# Altium project 自控mosV1.0.PrjPCB
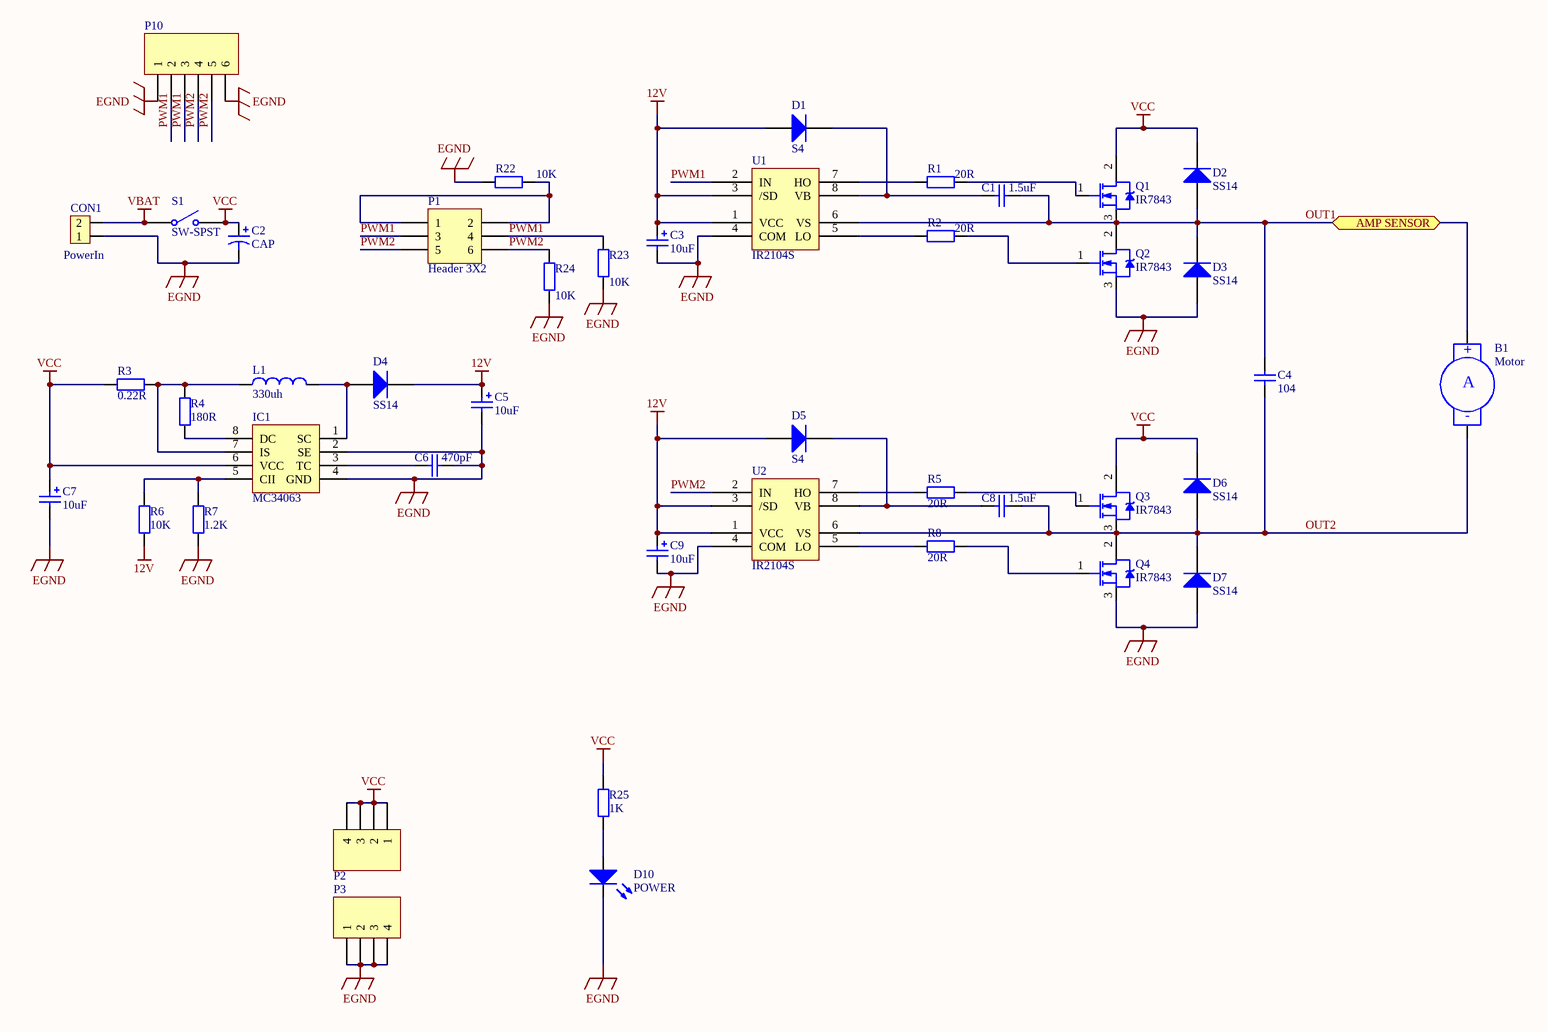
[diagram p0: 自控mosV1.0.SchDoc]
2 sheets, 103 parts. Net scope: flat (ports and power ports of the same name join across sheets).
Board files: 自控mos驱动.PcbDoc, 自控开板V1.PcbDoc
Sheets:
  自控mosV1.0.SchDoc
  主控板加电流检测v1.SchDoc

## Sheet 自控mosV1.0.SchDoc
size A3

### Parts
B1  Motor  [KF301-2P]
C1  value 1.5uF  [C2012]  (hidden comment: Cap)
C2  CAP  [SMD-EC-F5]
C3  value 10uF  [C2012]  (hidden comment: Cap Pol1)
C4  value 104  [C2012]  (hidden comment: Cap)
C5  value 10uF  [1206C]  (hidden comment: Cap Pol1)
C6  value 470pF  [C2012]  (hidden comment: Cap)
C7  value 10uF  [1206C]  (hidden comment: Cap Pol1)
C8  value 1.5uF  [C2012]  (hidden comment: Cap)
C9  value 10uF  [C2012]  (hidden comment: Cap Pol1)
CON1  PowerIn  [KF301-2P]
D1  S4  [R2012]
D2  SS14  [hole-chip diode]
D3  SS14  [hole-chip diode]
D4  SS14  [hole-chip diode]
D5  S4  [R2012]
D6  SS14  [hole-chip diode]
D7  SS14  [hole-chip diode]
D10  POWER  [C2012]
IC1  MC34063  [MC34063]
L1  value 330uh  [SMD-EC-F12.5]  (hidden comment: Inductor)
P1  Header 3X2  [HDR2X3]
P2  Header 4  [HDR1X4]  (value not drawn)
P3  Header 4  [HDR1X4]  (value not drawn)
P10  Header 6  [FFC/SM1.0-2H6]  (value not drawn)
Q1  IR7843  [LR7843]
Q2  IR7843  [LR7843]
Q3  IR7843  [LR7843]
Q4  IR7843  [LR7843]
R1  value 20R  [R2012]  (hidden comment: Res2)
R2  value 20R  [R2012]  (hidden comment: Res2)
R3  value 0.22R  [SK54]  (hidden comment: Res2)
R4  value 180R  [R2012]  (hidden comment: Res2)
R5  value 20R  [R2012]  (hidden comment: Res2)
R6  value 10K  [R2012]  (hidden comment: Res2)
R7  value 1.2K  [R2012]  (hidden comment: Res2)
R8  value 20R  [R2012]  (hidden comment: Res2)
R22  value 10K  [1206(2)]  (hidden comment: Res2)
R23  value 10K  [R2012]  (hidden comment: Res2)
R24  value 10K  [R2012]  (hidden comment: Res2)
R25  1K  [R2012]
S1  SW-SPST  [SW-125V6A(-)]
U1  IR2104S  [IR2104]
U2  IR2104S  [IR2104]

### Ports
AMP SENSOR

### Nets
12V: C3.1 C5.1 C9.1 D1.1(A) D4.2(K) D5.1(A) R6.1 U1.1(VCC) U1.3(/SD) U2.1(VCC) U2.3(/SD)
EGND: C2.2 C3.2 C5.2 C6.1 C7.2 C9.2 CON1.1 D3.1(A) D7.1(A) D10.2 IC1.2(SE) IC1.4(GND) P3.1 P3.2 P3.3 P3.4 P10.1 P10.6 Q2.3(S) Q4.3(S) R7.1 R22.1 R23.1 R24.1 U1.4(COM) U2.4(COM)
VBAT: CON1.2 S1.1(COMMON)
VCC: C2.1 C7.1 D2.2(K) D6.2(K) IC1.6(VCC) P2.1 P2.2 P2.3 P2.4 Q1.2(D) Q3.2(D) R3.1 R25.2 S1.2(NO)
OUT1: B1.1(+) C1.1 C4.1 D2.1(A) D3.2(K) Q1.3(S) Q2.2(D) U1.6(VS) ; port AMP SENSOR
OUT2: B1.2(-) C4.2 C8.1 D6.1(A) D7.2(K) Q3.3(S) Q4.2(D) U2.6(VS)
PWM1: P1.3 P1.4 P10.2 P10.3 R23.2 U1.2(IN)
PWM2: P1.5 P1.6 P10.4 P10.5 R24.2 U2.2(IN)
NetC1_2: C1.2 D1.2(K) U1.8(VB)
NetC6_2: C6.2 IC1.3(TC)
NetC8_2: C8.2 D5.2(K) U2.8(VB)
NetD4_1: D4.1(A) IC1.1(SC) L1.2
NetD10_1: D10.1 R25.1
NetIC1_5: IC1.5(CII) R6.2 R7.2
NetIC1_7: IC1.7(IS) L1.1 R3.2 R4.2
NetIC1_8: IC1.8(DC) R4.1
NetP1_1: P1.1 P1.2 R22.2
NetQ1_1: Q1.1(G) R1.2
NetQ2_1: Q2.1(G) R2.2
NetQ3_1: Q3.1(G) R5.2
NetQ4_1: Q4.1(G) R8.2
NetR1_1: R1.1 U1.7(HO)
NetR2_1: R2.1 U1.5(LO)
NetR5_1: R5.1 U2.7(HO)
NetR8_1: R8.1 U2.5(LO)

### Notes on the sheet
- (in symbol Motor Servo) A

### Library data of the parts
B1 = Motor Servo: Servo Motor
C1 C4 C6 C8 = Cap: Capacitor; Published: 8-Jun-2000; LatestRevisionDate: 17-Jul-2002; LatestRevisionNote: Re-released for DXP Platform.; PackageReference: RAD-0.3; Publisher: Altium Limited; PackageDescription: Radial Cap, Thru-Hole; 2 Leads; 0.3 in Pin Spacing
C2 = CAP+
C3 C5 C7 C9 = Cap Pol1: Polarized Capacitor (Radial); Published: 8-Jun-2000; LatestRevisionDate: 17-Jul-2002; LatestRevisionNote: Re-released for DXP Platform.; PackageReference: RB7.6-15; Publisher: Altium Limited; PackageDescription: Polarized Capacitor (Radial); 2 Leads
CON1 = Header 2: Header, 2-Pin
D1-D7 = Diode 1N4007: 1 Amp General Purpose Rectifier; Published: 8-Jun-2000; LatestRevisionDate: 17-Jul-2002; LatestRevisionNote: Re-released for DXP Platform.; DatasheetVersion: 1998; PackageVersion: Aug-1999; PackageReference: DO-41; Publisher: Altium Limited; Code_JEDEC: DO-204-AL; ComponentLink1Description: Manufacturer Link; ComponentLink1URL: http://www.fairchildsemi.com/; ComponentLink2Description: Datasheet; ComponentLink2URL: http://www.fairchildsemi.com/ds/1N%2F1N4001.pdf
D10 = LED: Typical INFRARED GaAs LED
L1 = Inductor: Code_IEC: 1005; Published: 8-Jun-2000; LatestRevisionDate: 29-May-2009; LatestRevisionNote: IPC-7351 Footprint Added.; PackageReference: 0402-A; Publisher: Altium Limited; PackageDescription: Chip Inductor; Code_JEITA: 0402
P1 = Header 3X2: Header, 3-Pin, Dual row; LatestRevisionDate: 17-Jul-2002; LatestRevisionNote: Re-released for DXP Platform.; Publisher: Altium Limited
P2 P3 = Header 4: Header, 4-Pin; LatestRevisionDate: 17-Jul-2002; LatestRevisionNote: Re-released for DXP Platform.; Publisher: Altium Limited
P10 = Header 6: Header, 6-Pin; LatestRevisionDate: 17-Jul-2002; LatestRevisionNote: Re-released for DXP Platform.; Publisher: Altium Limited
Q1-Q4 = NMOS-2: N-Channel Power MOSFET; Note: Pin 2 is electrically connected to pin 4.; Published: 8-Jun-2000; LatestRevisionDate: 17-Jul-2002; LatestRevisionNote: Re-released for DXP Platform.; DatasheetVersion: PD-9.814; PackageVersion: Feb-1997; PackageReference: TO-220AB; Publisher: Altium Limited; PackageDescription: TO, Thru-Hole, Vertical, Heatsink Mounted; 3 In-Line Leads; Pitch 2.54 mm; ComponentLink1Description: Manufacturer Link; ComponentLink1URL: http://www.irf.com/
R1 R2 R4-R8 R22-R24 = Res2: Resistor; Published: 8-Jun-2000; LatestRevisionDate: 17-Jul-2002; LatestRevisionNote: Re-released for DXP Platform.; PackageReference: AXIAL-0.4; Publisher: Altium Limited; PackageDescription: Axial Device, Thru-Hole; 2 Leads; 0.4 in Pin Spacing
R3 = Res2: Resistor; pin to pad: 1>K 2>A; Published: 8-Jun-2000; LatestRevisionDate: 17-Jul-2002; LatestRevisionNote: Re-released for DXP Platform.; PackageReference: AXIAL-0.4; Publisher: Altium Limited; PackageDescription: Axial Device, Thru-Hole; 2 Leads; 0.4 in Pin Spacing
R25 = Res: Resistor of led
S1 = SW-SPST: Single-Pole, Single-Throw Switch; Published: 24-Mar-1999; LatestRevisionDate: 17-Jul-2002; LatestRevisionNote: Re-released for DXP Platform.; PackageReference: SPST-2; Publisher: Altium Limited
U1 U2 = Component_1_1

## Sheet 主控板加电流检测v1.SchDoc
size A2
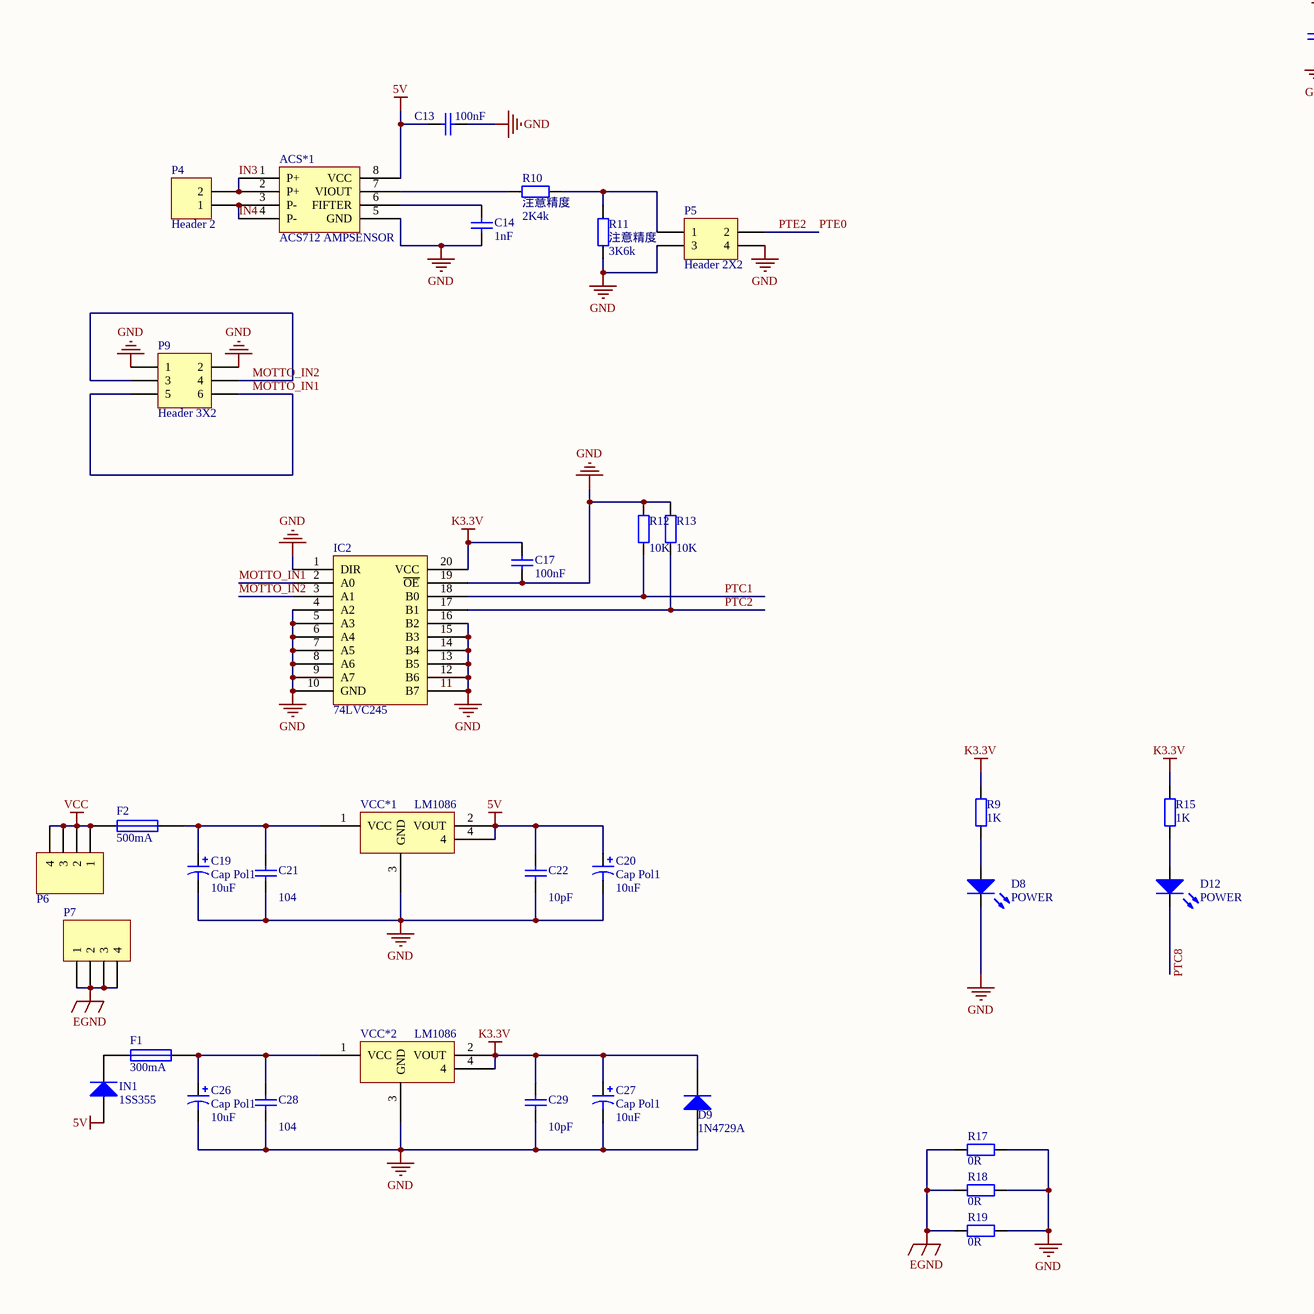
[diagram p1: 主控板加电流检测v1.SchDoc, left]
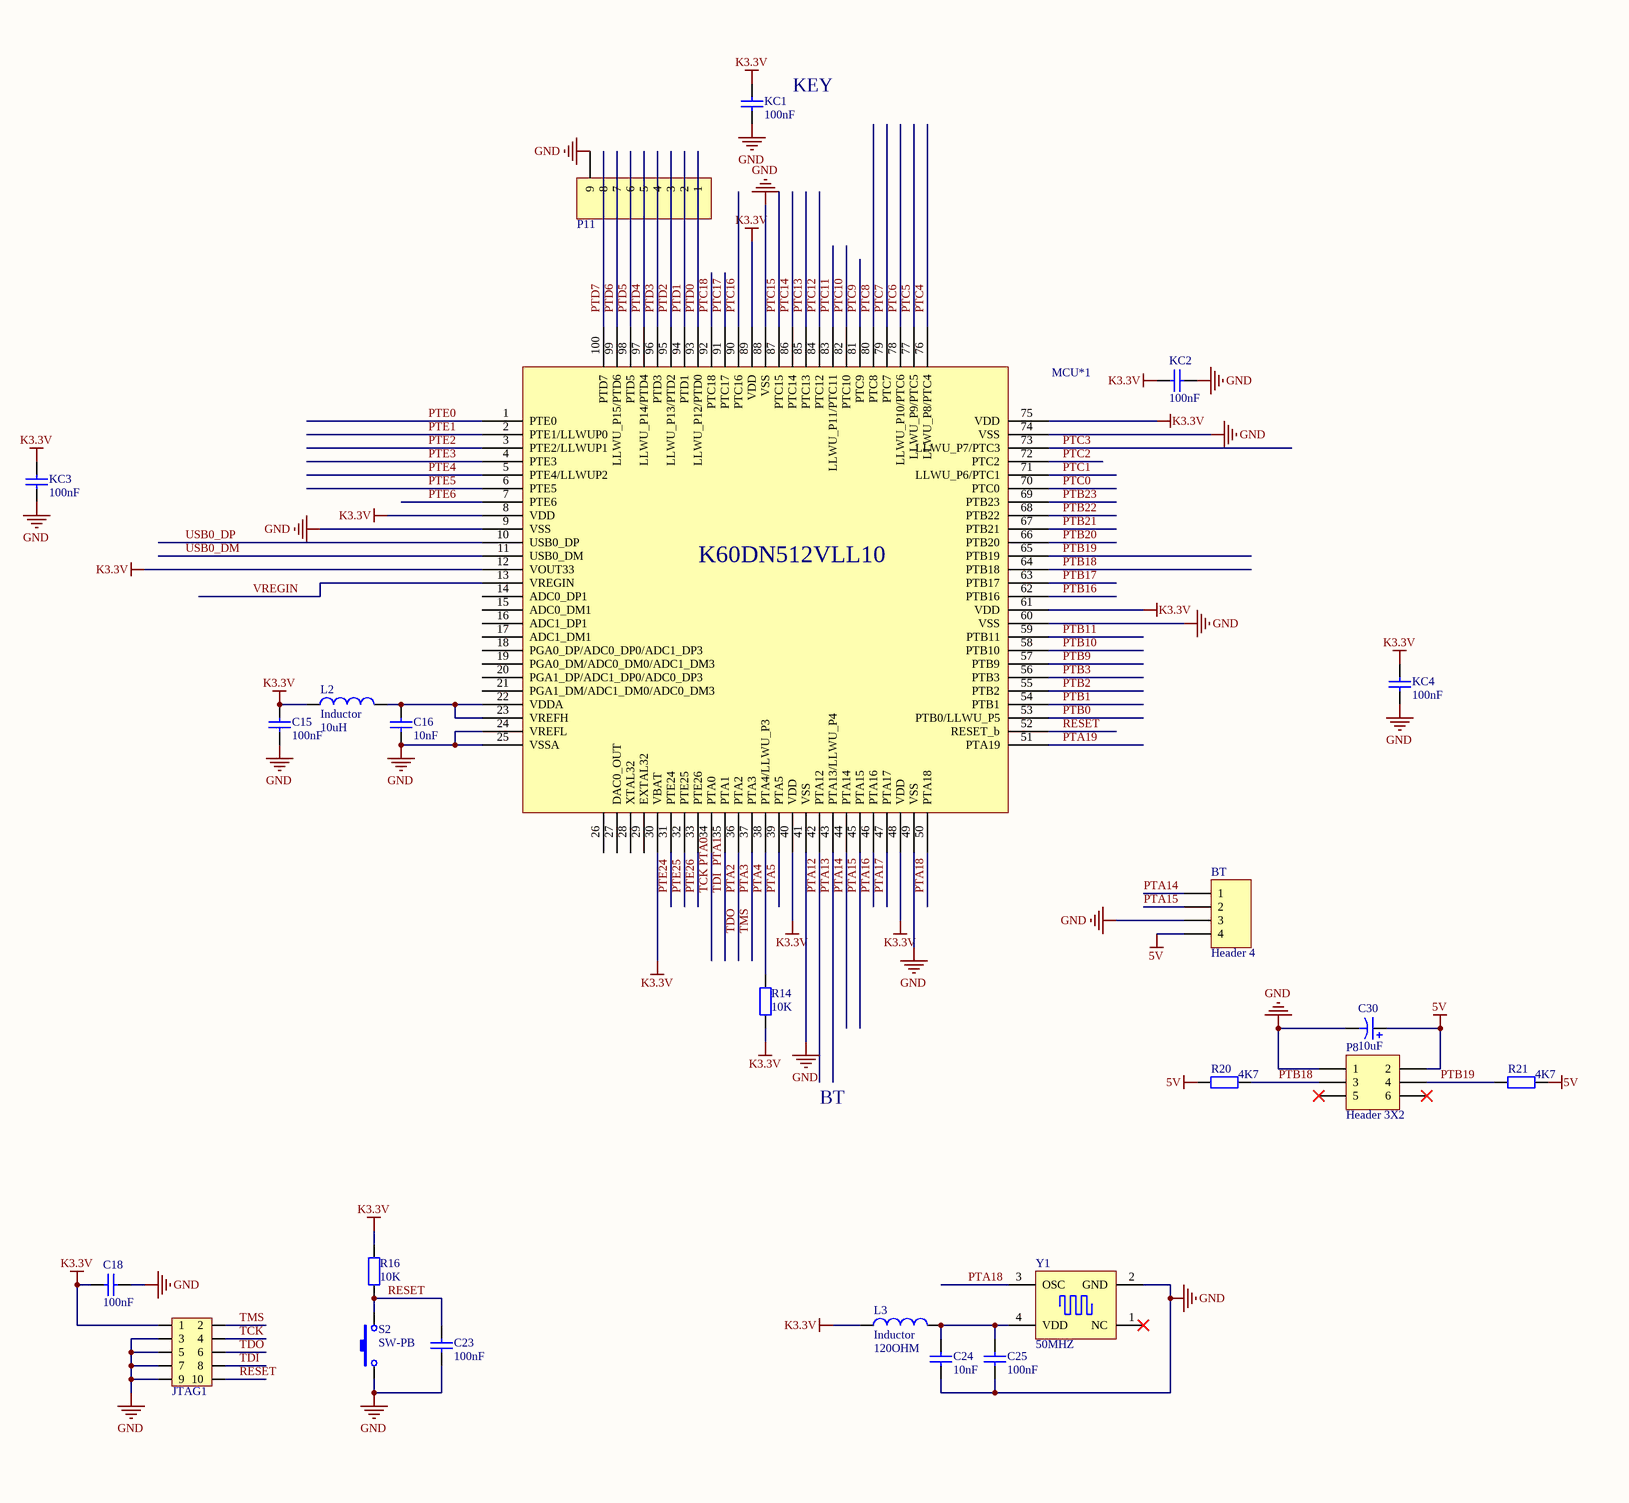
[diagram p2: 主控板加电流检测v1.SchDoc, right]

### Parts
ACS*1  ACS712 AMPSENSOR  [SOIC1-8N ACS712]
BT  Header 4  [HDR1X4]
C13  value 100nF  [C2012]  (hidden comment: Cap)
C14  value 1nF  [C2012]  (hidden comment: Cap)
C15  100nF  [C2012]
C16  10nF  [C2012]
C17  100nF  [C2012]
C18  100nF  [C2012]
C19  Cap Pol1  value 10uF  [1206(2)]
C20  Cap Pol1  value 10uF  [1206(2)]
C21  value 104  [C2012]  (hidden comment: Cap)
C22  value 10pF  [C2012]  (hidden comment: Cap)
C23  100nF  [C2012]
C24  10nF  [C2012]
C25  100nF  [C2012]
C26  Cap Pol1  value 10uF  [1206(2)]
C27  Cap Pol1  value 10uF  [1206(2)]
C28  value 104  [C2012]  (hidden comment: Cap)
C29  value 10pF  [C2012]  (hidden comment: Cap)
C30  value 10uF  [c2012]  (hidden comment: Cap Pol1)
D8  POWER  [C2012]
D9  1N4729A  [hole-chip diode]
D12  POWER  [C2012]
F1  300mA  [0805(2012)]
F2  500mA  [1206(2)]
IC2  74LVC245  [74LVC245 TSSOP]
IN1  1SS355  [1206(2)]
JTAG1  Header 5X2  [IDC5X2]  (value not drawn)
KC1  100nF  [C2012]
KC2  100nF  [C2012]
KC3  100nF  [C2012]
KC4  100nF  [C2012]
L2  Inductor  value 10uH  [C2012]
L3  Inductor  value 120OHM  [C2012]
MCU*1  k60P100  [LQFP100]  (value not drawn)
P4  Header 2  [KF301-2P]
P5  Header 2X2  [HDR2X2]
P6  Header 4  [HDR1X4]  (value not drawn)
P7  Header 4  [HDR1X4]  (value not drawn)
P8  Header 3X2  [HDR2X3]
P9  Header 3X2  [HDR2X3]
P11  Header 9  [FFC/SM1.0-2H9]  (value not drawn)
R9  1K  [R2012]
R10  注意精度  value 2K4k  [R2012]
R11  注意精度  value 3K6k  [R2012]
R12  value 10K  [R2012]  (hidden comment: Res2)
R13  value 10K  [R2012]  (hidden comment: Res2)
R14  10K  [R2012]
R15  1K  [R2012]
R16  10K  [R2012]
R17  value 0R  [1206(2)]  (hidden comment: Res2)
R18  value 0R  [1206(2)]  (hidden comment: Res2)
R19  value 0R  [1206(2)]  (hidden comment: Res2)
R20  value 4K7  [R2012]  (hidden comment: Res2)
R21  value 4K7  [R2012]  (hidden comment: Res2)
S2  SW-PB  [sw 3*4 *2]
VCC*1  LM1086  [DPAK LM2940]
VCC*2  LM1086  [lm1117]
Y1  50MHZ  [贴片有源晶体]

### Nets
5V: ACS*1.8(VCC) BT.4 C13.2 C20.1 C22.2 C30.1 IN1.1(A) P8.2 R20.2 R21.1 VCC*1.2(VOUT) VCC*1.4
EGND: P7.1 P7.2 P7.3 P7.4 R17.1 R18.1 R19.1
GND: ACS*1.5(GND) BT.3 C13.1 C14.2 C15.1 C16.1 C17.2 C18.2 C19.2 C20.2 C21.1 C22.1 C23.1 C24.1 C25.1 C26.2 C27.2 C28.1 C29.1 C30.2 D8.2 D9.1(A) IC2.1(DIR) IC2.4(A2) IC2.5(A3) IC2.6(A4) IC2.7(A5) IC2.8(A6) IC2.9(A7) IC2.10(GND) IC2.11(B7) IC2.12(B6) IC2.13(B5) IC2.14(B4) IC2.15(B3) IC2.16(B2) IC2.19(~{OE}) JTAG1.3 JTAG1.5 JTAG1.7 JTAG1.9 KC1.1 KC2.1 KC3.1 KC4.1 MCU*1.9(VSS) MCU*1.24(VREFL) MCU*1.25(VSSA) MCU*1.41(VSS) MCU*1.49(VSS) MCU*1.60(VSS) MCU*1.74(VSS) MCU*1.88(VSS) P5.3 P5.4 P8.1 P9.1 P9.2 P11.9 R11.1 R12.2 R13.2 R17.2 R18.2 R19.2 S2.1 VCC*1.3(GND) VCC*2.3(GND) Y1.2(GND)
K3.3V: C15.2 C17.1 C18.1 C27.1 C29.2 D9.2(K) IC2.20(VCC) JTAG1.1 KC1.2 KC2.2 KC3.2 KC4.2 L2.1 L3.1 MCU*1.8(VDD) MCU*1.12(VOUT33) MCU*1.30(VBAT) MCU*1.40(VDD) MCU*1.48(VDD) MCU*1.61(VDD) MCU*1.75(VDD) MCU*1.89(VDD) R9.2 R14.1 R15.2 R16.2 VCC*2.2(VOUT) VCC*2.4
VCC: F2.1 P6.1 P6.2 P6.3 P6.4
IN3: ACS*1.1(P+) ACS*1.2(P+) P4.2
IN4: ACS*1.3(P-) ACS*1.4(P-) P4.1
MOTTO_IN1: IC2.2(A0) P9.5 P9.6
MOTTO_IN2: IC2.3(A1) P9.3 P9.4
PTA0: JTAG1.4 MCU*1.34(PTA0)  [also labelled TCK]
PTA1: JTAG1.8 MCU*1.35(PTA1)  [also labelled TDI]
PTA2: JTAG1.6 MCU*1.36(PTA2)  [also labelled TDO]
PTA3: JTAG1.2 MCU*1.37(PTA3)  [also labelled TMS]
PTA4: MCU*1.38(PTA4/LLWU_P3) R14.2
PTA5: MCU*1.39(PTA5)
PTA12: MCU*1.42(PTA12)
PTA13: MCU*1.43(PTA13/LLWU_P4)
PTA14: BT.1 MCU*1.44(PTA14)
PTA15: BT.2 MCU*1.45(PTA15)
PTA16: MCU*1.46(PTA16)
PTA17: MCU*1.47(PTA17)
PTA18: MCU*1.50(PTA18) Y1.3(OSC)
PTA19: MCU*1.51(PTA19)
PTB0: MCU*1.53(PTB0/LLWU_P5)
PTB1: MCU*1.54(PTB1)
PTB2: MCU*1.55(PTB2)
PTB3: MCU*1.56(PTB3)
PTB9: MCU*1.57(PTB9)
PTB10: MCU*1.58(PTB10)
PTB11: MCU*1.59(PTB11)
PTB16: MCU*1.62(PTB16)
PTB17: MCU*1.63(PTB17)
PTB18: MCU*1.64(PTB18) P8.3 R20.1
PTB19: MCU*1.65(PTB19) P8.4 R21.2
PTB20: MCU*1.66(PTB20)
PTB21: MCU*1.67(PTB21)
PTB22: MCU*1.68(PTB22)
PTB23: MCU*1.69(PTB23)
PTC0: MCU*1.70(PTC0)
PTC1: IC2.18(B0) MCU*1.71(LLWU_P6/PTC1) R12.1
PTC2: IC2.17(B1) MCU*1.72(PTC2) R13.1
PTC3: MCU*1.73(LLWU_P7/PTC3)
PTC4: MCU*1.76(LLWU_P8/PTC4)
PTC5: MCU*1.77(LLWU_P9/PTC5)
PTC6: MCU*1.78(LLWU_P10/PTC6)
PTC7: MCU*1.79(PTC7)
PTC8: D12.2 MCU*1.80(PTC8)
PTC9: MCU*1.81(PTC9)
PTC10: MCU*1.82(PTC10)
PTC11: MCU*1.83(LLWU_P11/PTC11)
PTC12: MCU*1.84(PTC12)
PTC13: MCU*1.85(PTC13)
PTC14: MCU*1.86(PTC14)
PTC15: MCU*1.87(PTC15)
PTC16: MCU*1.90(PTC16)
PTC17: MCU*1.91(PTC17)
PTC18: MCU*1.92(PTC18)
PTD0: MCU*1.93(LLWU_P12/PTD0) P11.1
PTD1: MCU*1.94(PTD1) P11.2
PTD2: MCU*1.95(LLWU_P13/PTD2) P11.3
PTD3: MCU*1.96(PTD3) P11.4
PTD4: MCU*1.97(LLWU_P14/PTD4) P11.5
PTD5: MCU*1.98(PTD5) P11.6
PTD6: MCU*1.99(LLWU_P15/PTD6) P11.7
PTD7: MCU*1.100(PTD7) P11.8
PTE0: MCU*1.1(PTE0) MCU*1.3(PTE2/LLWUP1) P5.2  [also labelled PTE2]
PTE1: MCU*1.2(PTE1/LLWUP0)
PTE3: MCU*1.4(PTE3)
PTE4: MCU*1.5(PTE4/LLWUP2)
PTE5: MCU*1.6(PTE5)
PTE6: MCU*1.7(PTE6)
PTE24: MCU*1.31(PTE24)
PTE25: MCU*1.32(PTE25)
PTE26: MCU*1.33(PTE26)
RESET: C23.2 JTAG1.10 MCU*1.52(RESET_b) R16.1 S2.2
USB0_DM: MCU*1.11(USB0_DM)
USB0_DP: MCU*1.10(USB0_DP)
VREGIN: MCU*1.13(VREGIN)
NetACS*1_6: ACS*1.6(FIFTER) C14.1
NetACS*1_7: ACS*1.7(VIOUT) R10.1
NetC16_2: C16.2 L2.2 MCU*1.22(VDDA) MCU*1.23(VREFH)
NetC19_1: C19.1 C21.2 F2.2 VCC*1.1(VCC)
NetC24_2: C24.2 C25.2 L3.2 Y1.4(VDD)
NetC26_1: C26.1 C28.2 F1.1 VCC*2.1(VCC)
NetD8_1: D8.1 R9.1
NetD12_1: D12.1 R15.1
NetF1_2: F1.2 IN1.2(K)
NetP5_1: P5.1 R10.2 R11.2

Not connected (* = marked no-connect by the designer): MCU*1 14(ADC0_DP1) 15(ADC0_DM1) 16(ADC1_DP1) 17(ADC1_DM1) 18(PGA0_DP/ADC0_DP0/ADC1_DP3) 19(PGA0_DM/ADC0_DM0/ADC1_DM3) 20(PGA1_DP/ADC1_DP0/ADC0_DP3) 21(PGA1_DM/ADC1_DM0/ADC0_DM3) 26(VREF_OUT/CMP1_IN5CMP0_IN5/ADC1_SE18) 27(DAC0_OUT) 28(XTAL32) 29(EXTAL32); P8 5* 6*; Y1 1(NC)*

### Notes on the sheet
- (near KC1) KEY
- BT
- (in symbol k60P100) K60DN512VLL10

### Library data of the parts
BT P6 P7 = Header 4: Header, 4-Pin; LatestRevisionDate: 17-Jul-2002; LatestRevisionNote: Re-released for DXP Platform.; Publisher: Altium Limited
C13-C18 C23-C25 KC1-KC4 = Cap: Capacitor
  C13 C14: Published: 8-Jun-2000; LatestRevisionDate: 17-Jul-2002; LatestRevisionNote: Re-released for DXP Platform.; PackageReference: RAD-0.3; Publisher: Altium Limited; PackageDescription: Radial Cap, Thru-Hole; 2 Leads; 0.3 in Pin Spacing
C19 C20 C26 C27 C30 = Cap Pol1: Polarized Capacitor (Radial); Published: 8-Jun-2000; LatestRevisionDate: 17-Jul-2002; LatestRevisionNote: Re-released for DXP Platform.; PackageReference: RB7.6-15; Publisher: Altium Limited; PackageDescription: Polarized Capacitor (Radial); 2 Leads
C21 C22 C28 C29 = Cap: 贴片电容; Published: 8-Jun-2000; LatestRevisionDate: 17-Jul-2002; LatestRevisionNote: Re-released for DXP Platform.; PackageReference: RAD-0.3; Publisher: Altium Limited
D8 D12 = LED: Typical INFRARED GaAs LED
D9 IN1 = Diode 1N4148: High Conductance Fast Diode; LatestRevisionDate: 17-Jul-2002; LatestRevisionNote: Re-released for DXP Platform.; DatasheetDocument: 1997; PackageReference: DO-35; Publisher: Altium Limited; Code_JEDEC: DO-204-AH; ComponentLink1Description: Manufacturer Link; ComponentLink2Description: Datasheet; ComponentLink2URL: http://www.fairchildsemi.com/ds/1N%2F1N4148.pdf
F1 F2 = Fuse 1: Fuse; Published: 8-Jun-2000; LatestRevisionDate: 17-Jul-2002; LatestRevisionNote: Re-released for DXP Platform.; PackageReference: PIN-W2/E2.8; Publisher: Altium Limited
JTAG1 = Header 5X2: Header, 5-Pin, Dual row
L2 L3 = Inductor: Code_IEC: 1005; Published: 8-Jun-2000; LatestRevisionDate: 29-May-2009; LatestRevisionNote: IPC-7351 Footprint Added.; PackageReference: 0402-A; Publisher: Altium Limited; PackageDescription: Chip Inductor; Code_JEITA: 0402
P4 = Header 2: Header, 2-Pin; LatestRevisionDate: 17-Jul-2002; LatestRevisionNote: Re-released for DXP Platform.; Publisher: Altium Limited
P5 = Header 2X2: Header, 2-Pin, Dual row; LatestRevisionDate: 17-Jul-2002; LatestRevisionNote: Re-released for DXP Platform.; Publisher: Altium Limited
P8 P9 = Header 3X2: Header, 3-Pin, Dual row; LatestRevisionDate: 17-Jul-2002; LatestRevisionNote: Re-released for DXP Platform.; Publisher: Altium Limited
P11 = Header 9: Header, 9-Pin; LatestRevisionDate: 17-Jul-2002; LatestRevisionNote: Re-released for DXP Platform.; Publisher: Altium Limited
R9 R14 R15 = Res: Resistor of led
R10-R13 R17-R21 = Res2: Resistor; Published: 8-Jun-2000; LatestRevisionDate: 17-Jul-2002; LatestRevisionNote: Re-released for DXP Platform.; PackageReference: AXIAL-0.4; Publisher: Altium Limited; PackageDescription: Axial Device, Thru-Hole; 2 Leads; 0.4 in Pin Spacing
R16 = Res: Resistor
S2 = SW-PB: Switch
VCC*1 VCC*2 = LM1086: pin to pad: 1>3 3>1
Y1 = XTAL1

## Nets that join several sheets
EGND: 自控mosV1.0 (26 pins), 主控板加电流检测v1 (7 pins)
VCC: 自控mosV1.0 (14 pins), 主控板加电流检测v1 (5 pins)